# Altium schematic sheet Audio_Output_Line_Out.SchDoc: NIH DE0 Nano: Audio Output: Line Out
size A4; Author: Connor Dack; Engineer: Connor Dack; Revision: 001; SheetNumber: 8; SheetTotal: 9
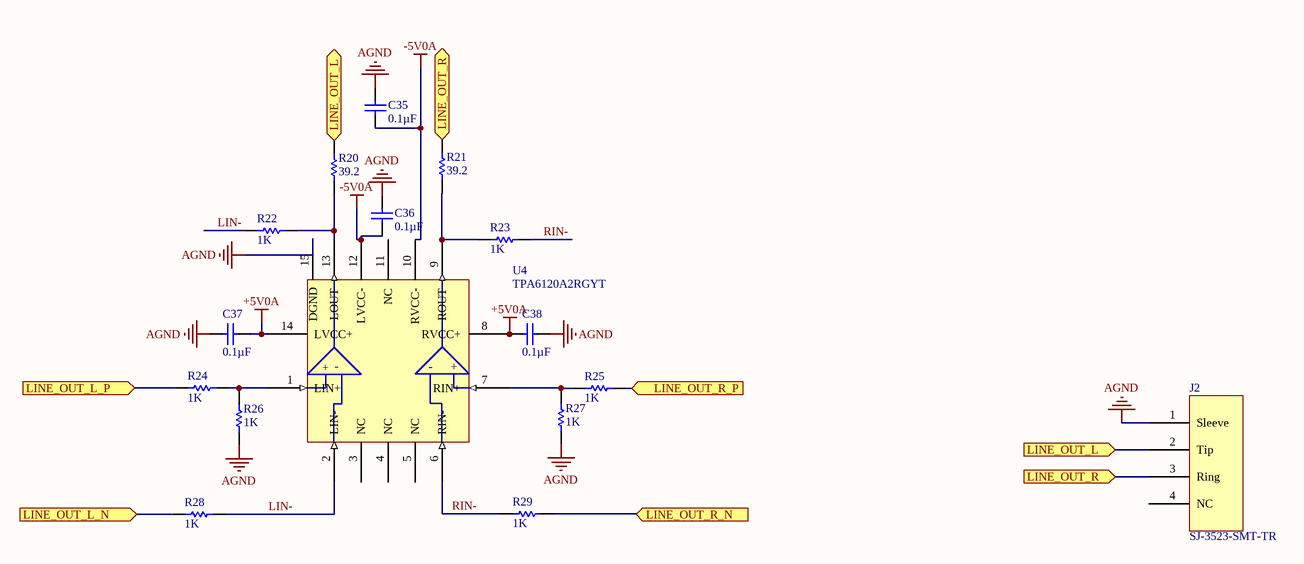
[diagram p0: Audio_Output_Line_Out.SchDoc]

## Parts
C35  Capacitance: 0.1µF  [3-0603_L]  (hidden comment: C1608X7R1H104K)
C36  Capacitance: 0.1µF  [3-0603_L]  (hidden comment: C1608X7R1H104K)
C37  Capacitance: 0.1µF  [3-0603_L]  (hidden comment: C1608X7R1H104K)
C38  Capacitance: 0.1µF  [3-0603_L]  (hidden comment: C1608X7R1H104K)
J2  SJ-3523-SMT-TR  [SJ-3523-SMT-TR]
R20  Resistance (Ohms): 39.2  [3-0603_R_L]  (hidden comment: ERJ-3EKF39R2V)
R21  Resistance (Ohms): 39.2  [3-0603_R_L]  (hidden comment: ERJ-3EKF39R2V)
R22  Resistance (Ohms): 1K  [3-0603_R_L]  (hidden comment: ERJ-3EKF1001V)
R23  Resistance (Ohms): 1K  [3-0603_R_L]  (hidden comment: ERJ-3EKF1001V)
R24  Resistance (Ohms): 1K  [3-0603_R_L]  (hidden comment: ERJ-3EKF1001V)
R25  Resistance (Ohms): 1K  [3-0603_R_L]  (hidden comment: ERJ-3EKF1001V)
R26  Resistance (Ohms): 1K  [3-0603_R_L]  (hidden comment: ERJ-3EKF1001V)
R27  Resistance (Ohms): 1K  [3-0603_R_L]  (hidden comment: ERJ-3EKF1001V)
R28  Resistance (Ohms): 1K  [3-0603_R_L]  (hidden comment: ERJ-3EKF1001V)
R29  Resistance (Ohms): 1K  [3-0603_R_L]  (hidden comment: ERJ-3EKF1001V)
U4  TPA6120A2RGYT  [PQFN50P350X350X100_HS-15N]

## Ports
LINE_OUT_L (in), LINE_OUT_L (out), LINE_OUT_L_N (in), LINE_OUT_L_P (in), LINE_OUT_R (in), LINE_OUT_R (out), LINE_OUT_R_N (in), LINE_OUT_R_P (in)

## Nets
+5V0A: C37.2 C38.2 U4.8(RVCC+) U4.14(LVCC+)
-5V0A: C35.2 C36.2 U4.10(RVCC-) U4.12(LVCC-)
AGND: C35.1 C36.1 C37.1 C38.1 J2.1(Sleeve) R26.1 R27.1 U4.15(DGND)
LIN-: R22.1 R28.2 U4.2(LIN-)
LINE_OUT_L: J2.2(Tip) R20.1 ; port LINE_OUT_L
LINE_OUT_L_N: R28.1 ; port LINE_OUT_L_N
LINE_OUT_L_P: R24.1 ; port LINE_OUT_L_P
LINE_OUT_R: J2.3(Ring) R21.1 ; port LINE_OUT_R
LINE_OUT_R_N: R29.2 ; port LINE_OUT_R_N
LINE_OUT_R_P: R25.2 ; port LINE_OUT_R_P
RIN-: R23.1 R29.1 U4.6(RIN-)
NetR20_2: R20.2 R22.2 U4.13(LOUT)
NetR21_2: R21.2 R23.2 U4.9(ROUT)
NetR24_2: R24.2 R26.2 U4.1(LIN+)
NetR25_1: R25.1 R27.2 U4.7(RIN+)

Not connected (* = marked no-connect by the designer): J2 4(NC); U4 3(NC) 4(NC) 5(NC) 11(NC)

## Notes on the sheet
- Title:
- Sheet:
- of
- Size:
- A4
- Rev:
- Date:
- Engineer:
- Time:
- File:
- (in symbol TPA6120A2RGYT) -; +

## Library data of the parts
C35-C38 = C1608X7R1H104K: CAP CER 0.1UF 50V 10% X7R 0603; Manufacturer: TDK Corporation; Supplier 1: Digi-Key; Manufacturer Part Number: C1608X7R1H104K; RoHS: RoHS Compliant; Category: Capacitors; Stock 1: 2442296; Pricing 1: 10=0.048, 100=0.022, 250=0.018, 500=0.0154, 1000=0.012 (USD); Voltage - Rated: 50V; Tolerance: ±10%; Temperature Coefficient: X7R; Mounting Type: Surface Mount, MLCC; Operating Temperature: -55°C ~ 125°C; Applications: General Purpose; Ratings: -; Package / Case: 0603 (1608 Metric); Size / Dimension: 0.063" L x 0.031" W (1.60mm x 0.80mm); Height - Seated (Max): -; Thickness (Max): 0.037" (0.95mm); Lead Spacing: -; Features: -; Packaging: Cut Tape (CT); Lead Style: -; ComponentLink1URL: http://www.tdk.com/pdf/general_B11.pdf; ComponentLink1Description: http://www.tdk.com/pdf/general_B11.pdf; Supplier Part Number 1: 445-1314-1-ND
J2 = SJ-3523-SMT-TR: 3.50mm (0.141", 1/8", Mini Plug) - Headphone Phone Jack Stereo Connector Solder; Manufacturer: CUI Inc.; Gender: Female; Actual Diameter: 0.142" (3.60mm); Number of Positions/Contacts: 3 Conductors, 3 Contacts; Internal Switch(s): Does Not Contain Switch; Shielding: Unshielded; Voltage - Rated: 12VDC; Current Rating: 1A; Mating Length/Depth: 0.551" (14.00mm); Body Color: Black; Includes: 1 pc - 1 Connector; LatestRevisionDate: 17-Jul-2002; LatestRevisionNote: Re-released for DXP Platform.; Publisher: Altium Limited; Supplier 1: Digi-Key; RoHS: RoHS Compliant; Category: Connectors, Interconnects; Stock 1: 104981; Pricing 1: 1=1.34, 10=1.043, 100=0.7961, 500=0.63558 (USD); Packaging: Cut Tape (CT); Part Status: Active; Connector Type: Phone Jack; Signal Lines: Stereo; Industry Recognized Mating Diameter: 3.50mm (0.141", 1/8", Mini Plug) - Headphone; Mounting Type: Surface Mount, Right Angle; Termination: Solder; Features: Board Guide; Insulation Color: -; Contact Material - Plating: Silver; Body Material: -; ComponentLink1URL: http://www.cui.com/product/resource/digikeypdf/sj-352x-smt_series.pdf; ComponentLink1Description: http://www.cui.com/product/resource/digikeypdf/sj-352x-smt_series.pdf; Supplier Part Number 1: CP-3523SJCT-ND; Manufacturer Part Number: SJ-3523-SMT-TR
R20 R21 = ERJ-3EKF39R2V: n RES SMD 39.2 OHM 1% 1/10W 0603; Manufacturer: Panasonic Electronic Components; Power (Watts): 0.1W, 1/10W; Temperature Coefficient: ±100ppm/°C; Supplier 1: Digi-Key; Manufacturer Part Number: ERJ-3EKF39R2V; RoHS: RoHS Compliant; Category: Resistors; Stock 1: 34148; Pricing 1: 1=0.1, 50=0.0114, 100=0.0084, 250=0.00644, 500=0.00514, 1000=0.00379 (USD); Packaging: Cut Tape (CT); Part Status: Active; Tolerance: ±1%; Composition: Thick Film; Features: Automotive AEC-Q200; Operating Temperature: -55°C ~ 155°C; Package / Case: 0603 (1608 Metric); Supplier Device Package: 0603; Size / Dimension: 0.063" L x 0.031" W (1.60mm x 0.80mm); Height: 0.022" (0.55mm); Number of Terminations: 2; ComponentLink1URL: http://industrial.panasonic.com/www-cgi/jvcr13pz.cgi?E+PZ+3+AOA0002+ERJ3EKF39R2V+7+WW; ComponentLink1Description: http://industrial.panasonic.com/www-cgi/jvcr13pz.cgi?E+PZ+3+AOA0002+ERJ3EKF39R2V+7+WW; Supplier Part Number 1: P39.2HCT-ND
R22-R29 = ERJ-3EKF1001V: RES 1.00K OHM 1/10W 1% 0603 SMD; Manufacturer: Panasonic - ECG; Power (Watts): 0.1W, 1/10W; Temperature Coefficient: ±100ppm/°C; Supplier 1: Digi-Key; Manufacturer Part Number: ERJ-3EKF1001V; RoHS: RoHS Compliant; Category: Resistors; Stock 1: 5088743; Pricing 1: 1=0.04, 50=0.0138, 100=0.0105, 250=0.0078, 500=0.00576, 1000=0.00384 (USD); Composition: Thick Film; Features: -; Tolerance: ±1%; Package / Case: 0603 (1608 Metric); Size / Dimension: 0.063" L x 0.031" W (1.60mm x 0.80mm); Height: 0.022" (0.55mm); Number of Terminations: 2; Packaging: Cut Tape (CT); ComponentLink1URL: http://industrial.panasonic.com/www-cgi/jvcr13pz.cgi?E+PZ+3+AOA0002+ERJ3EKF1001V+7+WW; ComponentLink1Description: http://industrial.panasonic.com/www-cgi/jvcr13pz.cgi?E+PZ+3+AOA0002+ERJ3EKF1001V+7+WW; Supplier Part Number 1: P1.00KHCT-ND
U4 = TPA6120A2RGYT: Amplifier IC Headphones, 2-Channel (Stereo) Class AB 14-VQFN (3.5x3.5); Manufacturer: Texas Instruments; Max Output Power x Channels @ Load: 80mW x 2 @ 600 Ohm; Voltage - Supply: 10 V ~ 30 V, ±5 V ~ 15 V; LatestRevisionDate: 17-Jul-2002; LatestRevisionNote: Re-released for DXP Platform.; Publisher: Altium Limited; Supplier 1: Digi-Key; RoHS: RoHS Compliant; Category: Integrated Circuits (ICs); Stock 1: 867; Pricing 1: 1=6.04, 10=5.424, 100=4.4501 (USD); Packaging: Cut Tape (CT); Part Status: Active; Type: Class AB; Output Type: Headphones, 2-Channel (Stereo); Features: Differential Inputs, Short-Circuit and Thermal Protection; Mounting Type: Surface Mount; Operating Temperature: -40°C ~ 85°C (TA); Supplier Device Package: 14-VQFN (3.5x3.5); Package / Case: 14-VFQFN Exposed Pad; ComponentLink1URL: http://www.ti.com/lit/ds/symlink/tpa6120a2.pdf; ComponentLink1Description: http://www.ti.com/lit/ds/symlink/tpa6120a2.pdf; Supplier Part Number 1: 296-38029-1-ND; Manufacturer Part Number: TPA6120A2RGYT